# Altium schematic sheet IMX385_PINOUT.SchDoc
size C; SheetNumber: 2; SheetTotal: 3
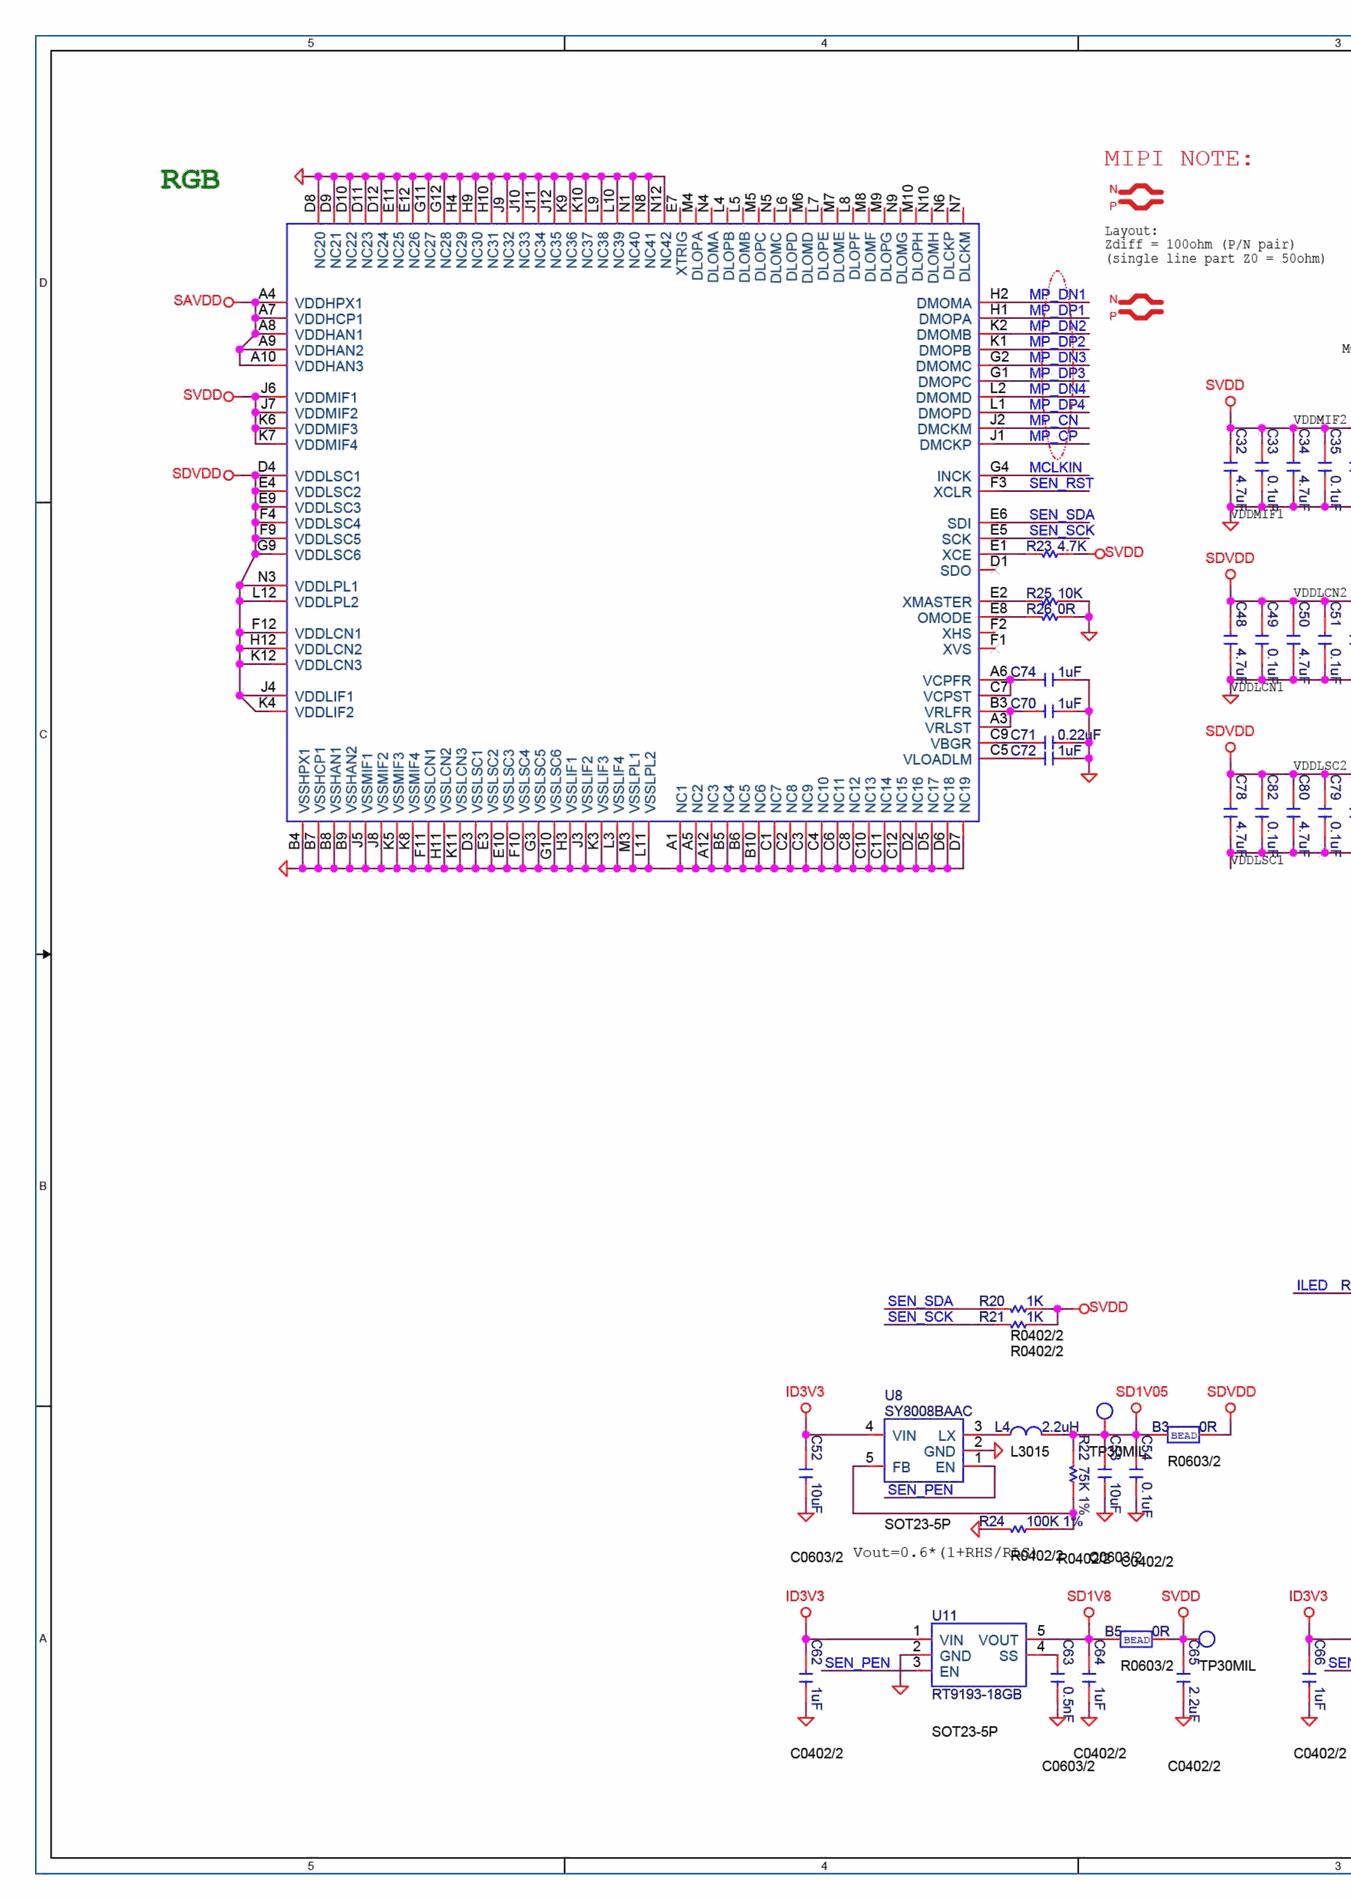
[diagram p0: IMX385_PINOUT.SchDoc, top left]
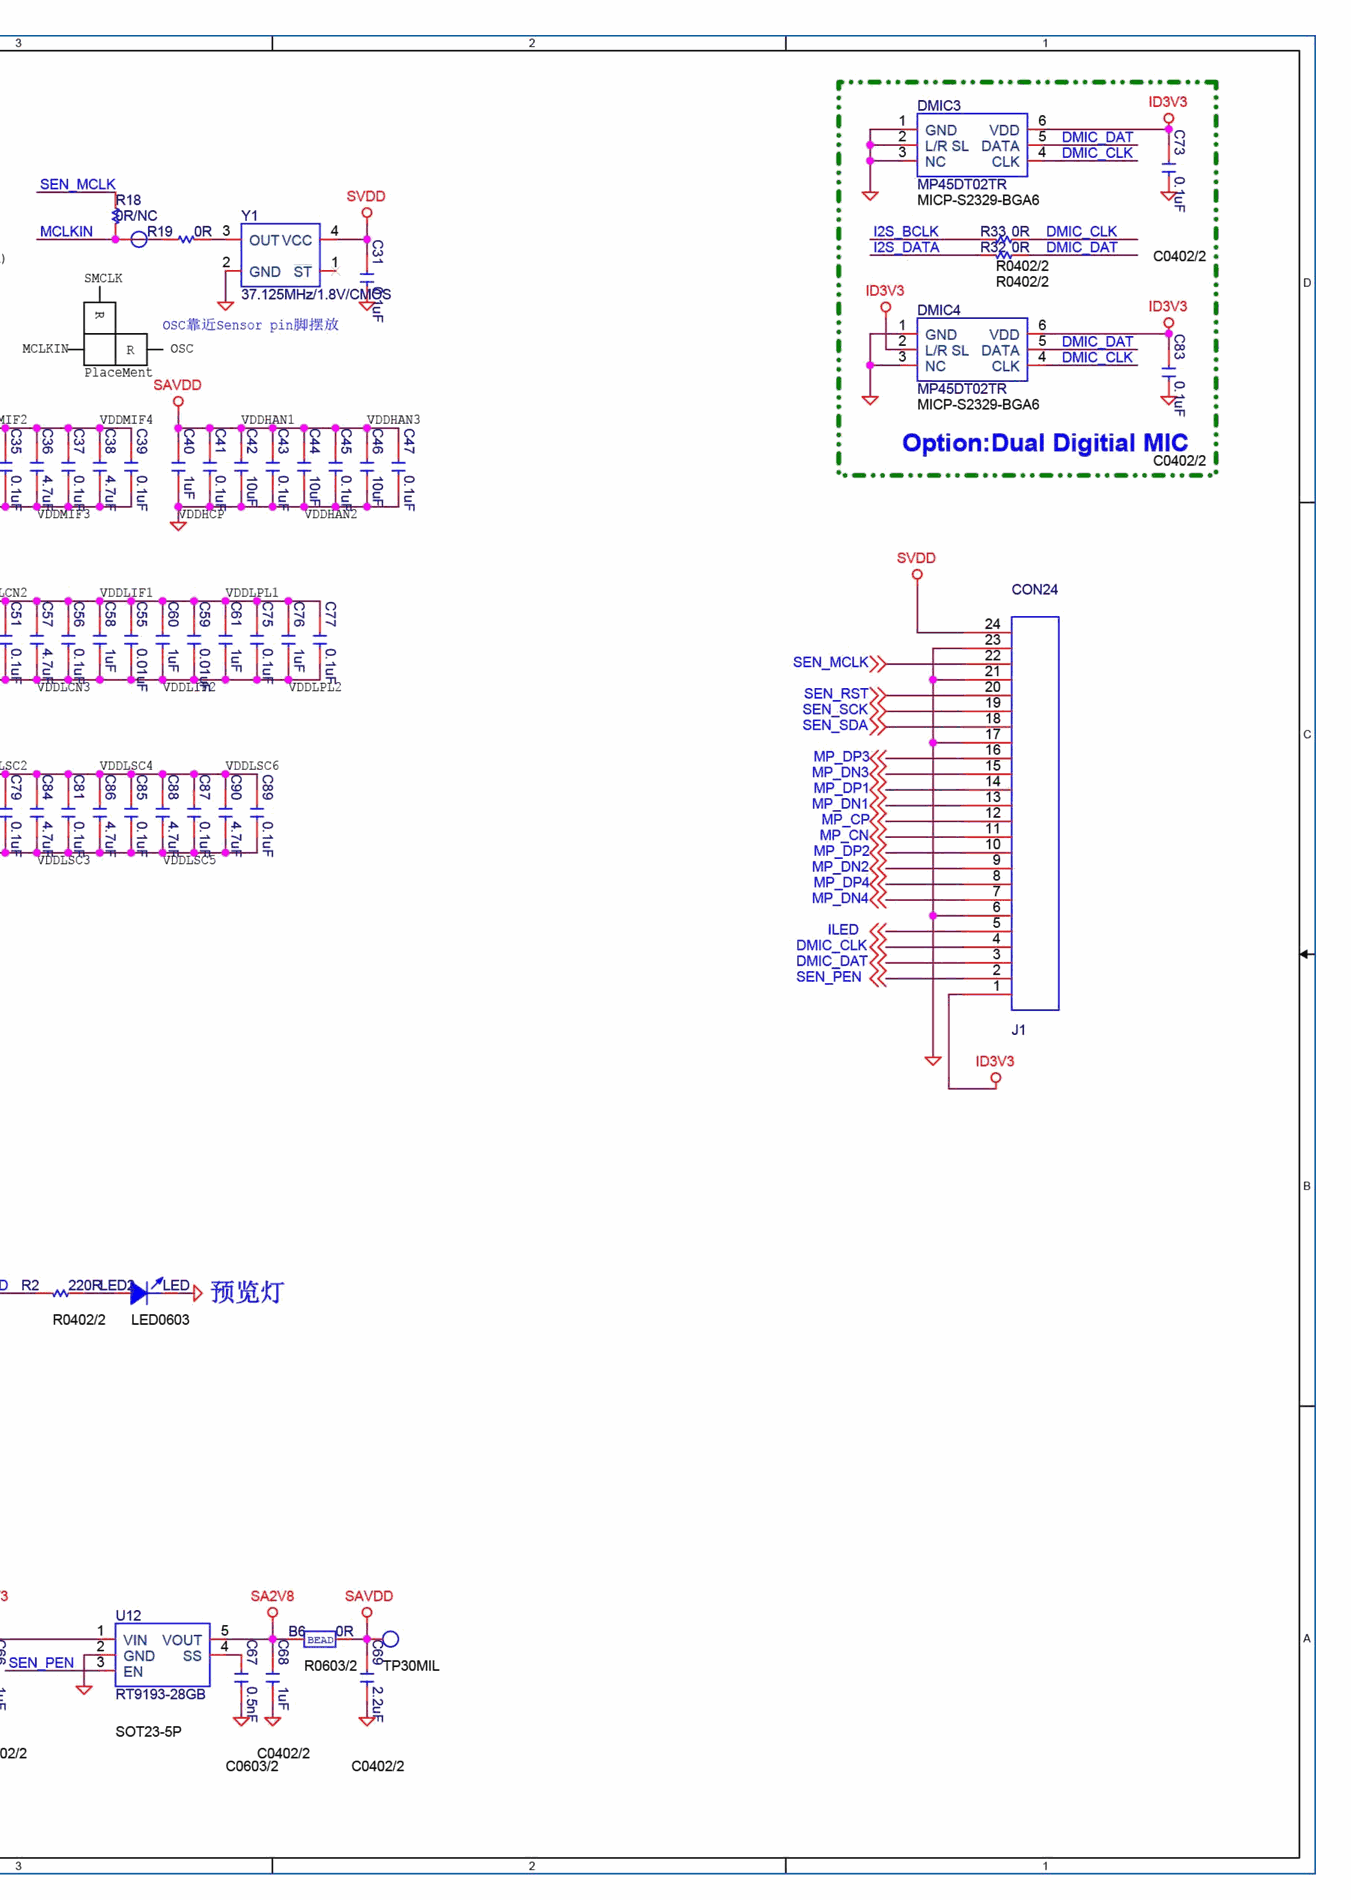
[diagram p1: IMX385_PINOUT.SchDoc, top right]
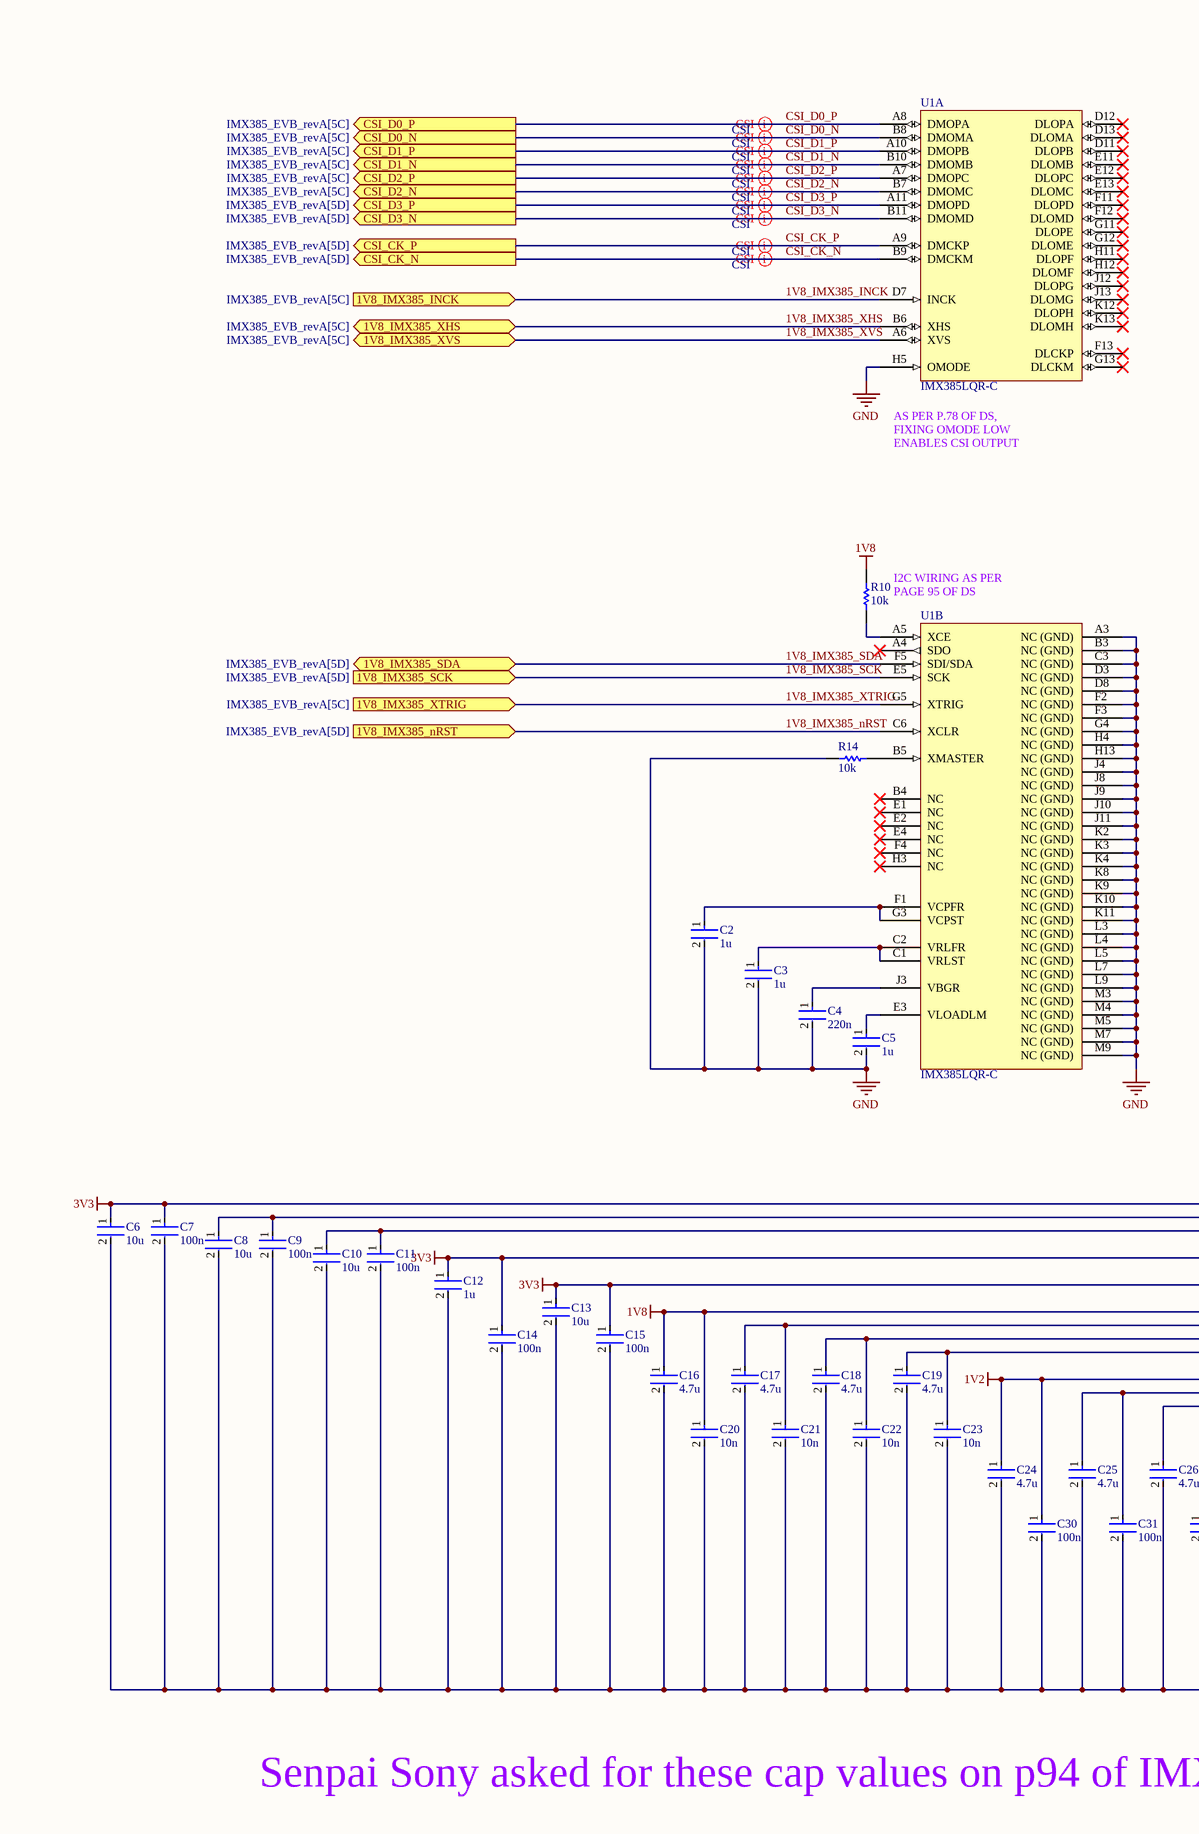
[diagram p2: IMX385_PINOUT.SchDoc, bottom left]
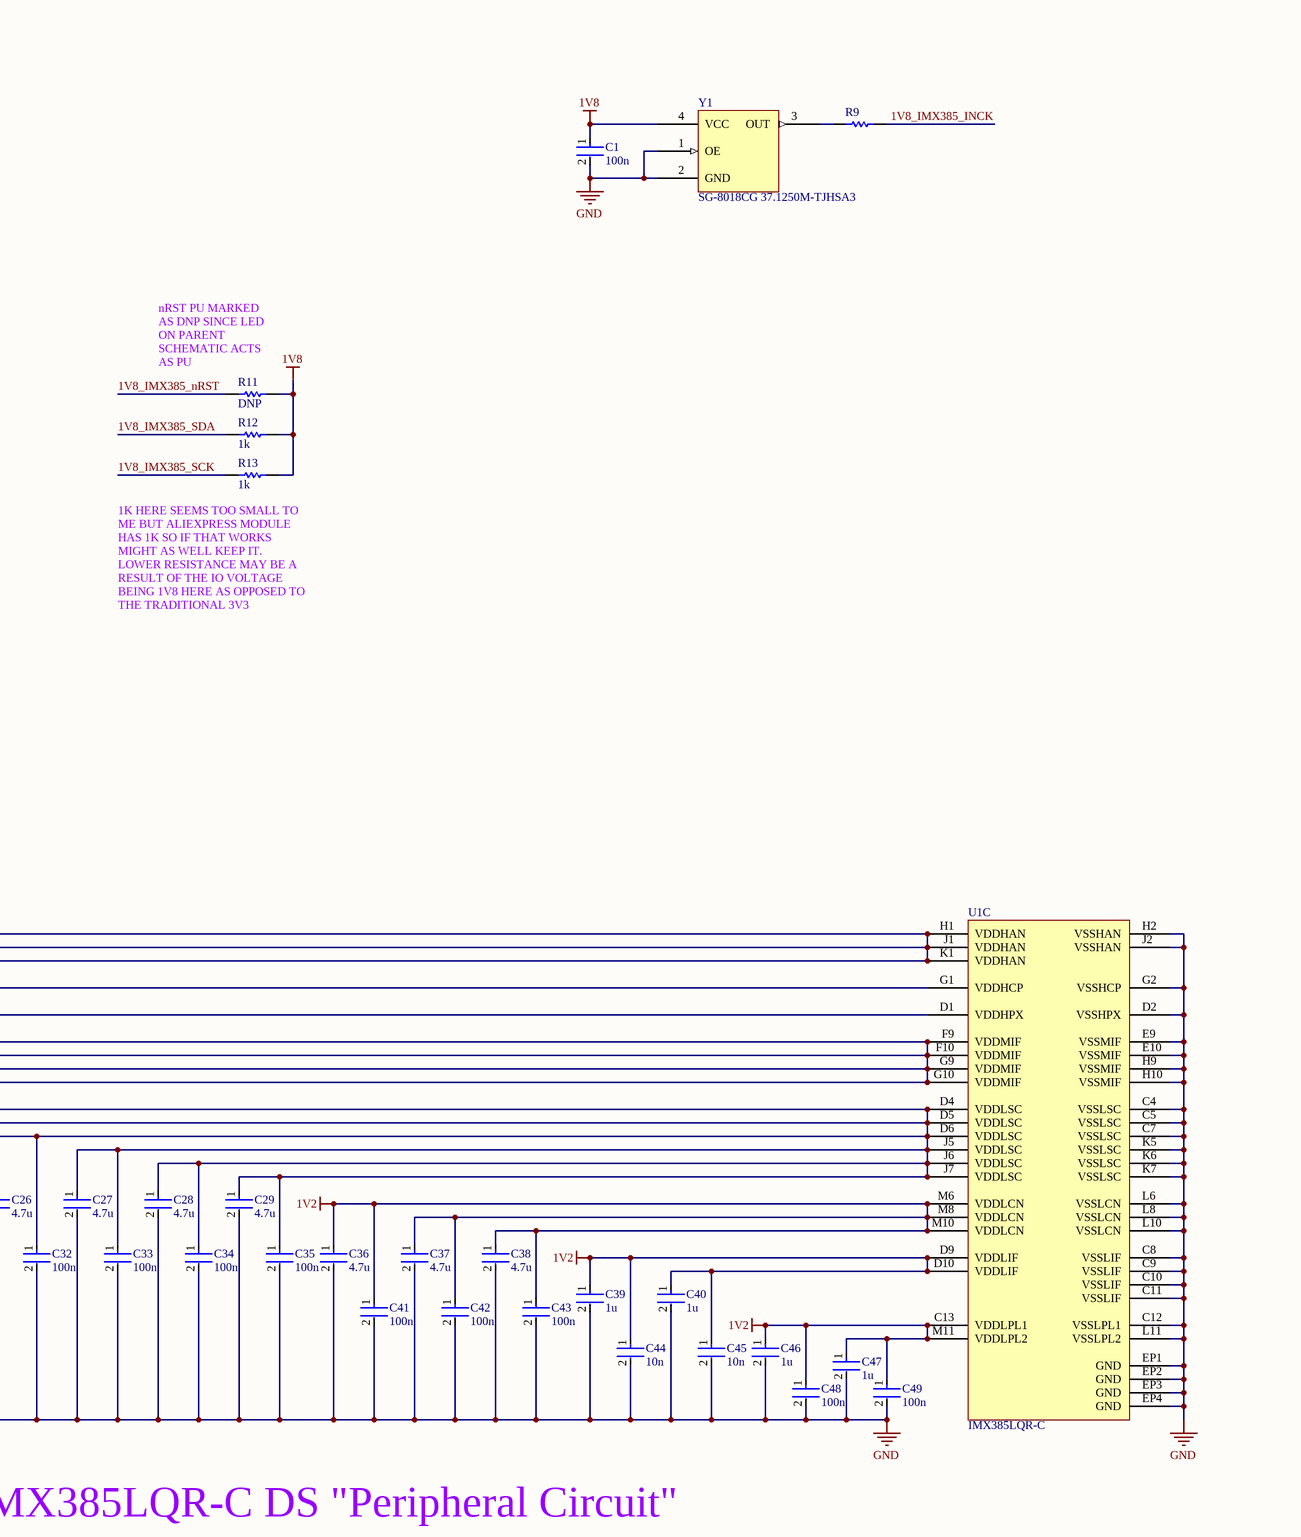
[diagram p3: IMX385_PINOUT.SchDoc, bottom right]

## Parts
C1  100n  [FP-0402-L_1_0_0_05-W_0_5-IPC_A]
C2  1u  [FP-0402-L_1_0_0_05-W_0_5-IPC_A]
C3  1u  [FP-0402-L_1_0_0_05-W_0_5-IPC_A]
C4  220n  [FP-0402-L_1_0_0_05-W_0_5-IPC_A]
C5  1u  [FP-0402-L_1_0_0_05-W_0_5-IPC_A]
C6  10u  [FP-0402-L_1_0_0_05-W_0_5-IPC_A]
C7  100n  [FP-0402-L_1_0_0_05-W_0_5-IPC_A]
C8  10u  [FP-0402-L_1_0_0_05-W_0_5-IPC_A]
C9  100n  [FP-0402-L_1_0_0_05-W_0_5-IPC_A]
C10  10u  [FP-0402-L_1_0_0_05-W_0_5-IPC_A]
C11  100n  [FP-0402-L_1_0_0_05-W_0_5-IPC_A]
C12  1u  [FP-0402-L_1_0_0_05-W_0_5-IPC_A]
C13  10u  [FP-0402-L_1_0_0_05-W_0_5-IPC_A]
C14  100n  [FP-0402-L_1_0_0_05-W_0_5-IPC_A]
C15  100n  [FP-0402-L_1_0_0_05-W_0_5-IPC_A]
C16  4.7u  [FP-0402-L_1_0_0_05-W_0_5-IPC_A]
C17  4.7u  [FP-0402-L_1_0_0_05-W_0_5-IPC_A]
C18  4.7u  [FP-0402-L_1_0_0_05-W_0_5-IPC_A]
C19  4.7u  [FP-0402-L_1_0_0_05-W_0_5-IPC_A]
C20  10n  [FP-0402-L_1_0_0_05-W_0_5-IPC_A]
C21  10n  [FP-0402-L_1_0_0_05-W_0_5-IPC_A]
C22  10n  [FP-0402-L_1_0_0_05-W_0_5-IPC_A]
C23  10n  [FP-0402-L_1_0_0_05-W_0_5-IPC_A]
C24  4.7u  [FP-0402-L_1_0_0_05-W_0_5-IPC_A]
C25  4.7u  [FP-0402-L_1_0_0_05-W_0_5-IPC_A]
C26  4.7u  [FP-0402-L_1_0_0_05-W_0_5-IPC_A]
C27  4.7u  [FP-0402-L_1_0_0_05-W_0_5-IPC_A]
C28  4.7u  [FP-0402-L_1_0_0_05-W_0_5-IPC_A]
C29  4.7u  [FP-0402-L_1_0_0_05-W_0_5-IPC_A]
C30  100n  [FP-0402-L_1_0_0_05-W_0_5-IPC_A]
C31  100n  [FP-0402-L_1_0_0_05-W_0_5-IPC_A]
C32  100n  [FP-0402-L_1_0_0_05-W_0_5-IPC_A]
C33  100n  [FP-0402-L_1_0_0_05-W_0_5-IPC_A]
C34  100n  [FP-0402-L_1_0_0_05-W_0_5-IPC_A]
C35  100n  [FP-0402-L_1_0_0_05-W_0_5-IPC_A]
C36  4.7u  [FP-0402-L_1_0_0_05-W_0_5-IPC_A]
C37  4.7u  [FP-0402-L_1_0_0_05-W_0_5-IPC_A]
C38  4.7u  [FP-0402-L_1_0_0_05-W_0_5-IPC_A]
C39  1u  [FP-0402-L_1_0_0_05-W_0_5-IPC_A]
C40  1u  [FP-0402-L_1_0_0_05-W_0_5-IPC_A]
C41  100n  [FP-0402-L_1_0_0_05-W_0_5-IPC_A]
C42  100n  [FP-0402-L_1_0_0_05-W_0_5-IPC_A]
C43  100n  [FP-0402-L_1_0_0_05-W_0_5-IPC_A]
C44  10n  [FP-0402-L_1_0_0_05-W_0_5-IPC_A]
C45  10n  [FP-0402-L_1_0_0_05-W_0_5-IPC_A]
C46  1u  [FP-0402-L_1_0_0_05-W_0_5-IPC_A]
C47  1u  [FP-0402-L_1_0_0_05-W_0_5-IPC_A]
C48  100n  [FP-0402-L_1_0_0_05-W_0_5-IPC_A]
C49  100n  [FP-0402-L_1_0_0_05-W_0_5-IPC_A]
R9  0402 JUMPER  [RESC1005X40X25ML05T05]  (value not drawn)
R10  10k  [R0603B]
R11  DNP  [R0603B]
R12  1k  [R0603B]
R13  1k  [R0603B]
R14  10k  [R0603B]
U1  IMX385LQR-C  [BGA128C100P13X12_1500X1250X225]  (parts A,B,C of 3)
Y1  SG-8018CG 37.1250M-TJHSA3  [SG-8018CG 37.1250M-TJHSA3-Footprint-1]

## Ports
1V8_IMX385_INCK (in, see IMX385_EVB_revA[5C]), 1V8_IMX385_nRST (in, see IMX385_EVB_revA[5D]), 1V8_IMX385_SCK (in, see IMX385_EVB_revA[5D]), 1V8_IMX385_SDA (bidir, see IMX385_EVB_revA[5D]), 1V8_IMX385_XHS (bidir, see IMX385_EVB_revA[5C]), 1V8_IMX385_XTRIG (in, see IMX385_EVB_revA[5C]), 1V8_IMX385_XVS (bidir, see IMX385_EVB_revA[5C]), CSI_CK_N (out, see IMX385_EVB_revA[5D]), CSI_CK_P (out, see IMX385_EVB_revA[5D]), CSI_D0_N (out, see IMX385_EVB_revA[5C]), CSI_D0_P (out, see IMX385_EVB_revA[5C]), CSI_D1_N (out, see IMX385_EVB_revA[5C]), CSI_D1_P (out, see IMX385_EVB_revA[5C]), CSI_D2_N (out, see IMX385_EVB_revA[5C]), CSI_D2_P (out, see IMX385_EVB_revA[5C]), CSI_D3_N (out, see IMX385_EVB_revA[5D]), CSI_D3_P (out, see IMX385_EVB_revA[5D])

## Nets
1V2: C24.1 C25.1 C26.1 C27.1 C28.1 C29.1 C30.1 C31.1 C32.1 C33.1 C34.1 C35.1 C36.1 C37.1 C38.1 C39.1 C40.1 C41.1 C42.1 C43.1 C44.1 C45.1 C46.1 C47.1 C48.1 C49.1 U1.C13(VDDLPL1) U1.D4(VDDLSC) U1.D5(VDDLSC) U1.D6(VDDLSC) U1.D9(VDDLIF) U1.D10(VDDLIF) U1.J5(VDDLSC) U1.J6(VDDLSC) U1.J7(VDDLSC) U1.M6(VDDLCN) U1.M8(VDDLCN) U1.M10(VDDLCN) U1.M11(VDDLPL2)
1V8: C1.1 C16.1 C17.1 C18.1 C19.1 C20.1 C21.1 C22.1 C23.1 R10.2 R11.1 R12.2 R13.2 U1.F9(VDDMIF) U1.F10(VDDMIF) U1.G9(VDDMIF) U1.G10(VDDMIF) Y1.4(VCC)
3V3: C6.1 C7.1 C8.1 C9.1 C10.1 C11.1 C12.1 C13.1 C14.1 C15.1 U1.D1(VDDHPX) U1.G1(VDDHCP) U1.H1(VDDHAN) U1.J1(VDDHAN) U1.K1(VDDHAN)
GND: C1.2 C2.2 C3.2 C4.2 C5.2 C6.2 C7.2 C8.2 C9.2 C10.2 C11.2 C12.2 C13.2 C14.2 C15.2 C16.2 C17.2 C18.2 C19.2 C20.2 C21.2 C22.2 C23.2 C24.2 C25.2 C26.2 C27.2 C28.2 C29.2 C30.2 C31.2 C32.2 C33.2 C34.2 C35.2 C36.2 C37.2 C38.2 C39.2 C40.2 C41.2 C42.2 C43.2 C44.2 C45.2 C46.2 C47.2 C48.2 C49.2 R14.2 U1.A3(NC_(GND)) U1.B3(NC_(GND)) U1.C3(NC_(GND)) U1.C4(VSSLSC) U1.C5(VSSLSC) U1.C7(VSSLSC) U1.C8(VSSLIF) U1.C9(VSSLIF) U1.C10(VSSLIF) U1.C11(VSSLIF) U1.C12(VSSLPL1) U1.D2(VSSHPX) U1.D3(NC_(GND)) U1.D8(NC_(GND)) U1.E9(VSSMIF) U1.E10(VSSMIF) U1.EP1(GND) U1.EP2(GND) U1.EP3(GND) U1.EP4(GND) U1.F2(NC_(GND)) U1.F3(NC_(GND)) U1.G2(VSSHCP) U1.G4(NC_(GND)) U1.H2(VSSHAN) U1.H4(NC_(GND)) U1.H5(OMODE) U1.H9(VSSMIF) U1.H10(VSSMIF) U1.H13(NC_(GND)) U1.J2(VSSHAN) U1.J4(NC_(GND)) U1.J8(NC_(GND)) U1.J9(NC_(GND)) U1.J10(NC_(GND)) U1.J11(NC_(GND)) U1.K2(NC_(GND)) U1.K3(NC_(GND)) U1.K4(NC_(GND)) U1.K5(VSSLSC) U1.K6(VSSLSC) U1.K7(VSSLSC) U1.K8(NC_(GND)) U1.K9(NC_(GND)) U1.K10(NC_(GND)) U1.K11(NC_(GND)) U1.L3(NC_(GND)) U1.L4(NC_(GND)) U1.L5(NC_(GND)) U1.L6(VSSLCN) U1.L7(NC_(GND)) U1.L8(VSSLCN) U1.L9(NC_(GND)) U1.L10(VSSLCN) U1.L11(VSSLPL2) U1.M3(NC_(GND)) U1.M4(NC_(GND)) U1.M5(NC_(GND)) U1.M7(NC_(GND)) U1.M9(NC_(GND)) Y1.1(OE) Y1.2(GND)
1V8_IMX385_INCK: R9.2 U1.D7(INCK) ; port 1V8_IMX385_INCK
1V8_IMX385_nRST: R11.2 U1.C6(XCLR) ; port 1V8_IMX385_nRST
1V8_IMX385_SCK: R13.1 U1.E5(SCK) ; port 1V8_IMX385_SCK
1V8_IMX385_SDA: R12.1 U1.F5(SDI/SDA) ; port 1V8_IMX385_SDA
1V8_IMX385_XHS: U1.B6(XHS) ; port 1V8_IMX385_XHS
1V8_IMX385_XTRIG: U1.G5(XTRIG) ; port 1V8_IMX385_XTRIG
1V8_IMX385_XVS: U1.A6(XVS) ; port 1V8_IMX385_XVS
CSI_CK_N: U1.B9(DMCKM) ; port CSI_CK_N
CSI_CK_P: U1.A9(DMCKP) ; port CSI_CK_P
CSI_D0_N: U1.B8(DMOMA) ; port CSI_D0_N
CSI_D0_P: U1.A8(DMOPA) ; port CSI_D0_P
CSI_D1_N: U1.B10(DMOMB) ; port CSI_D1_N
CSI_D1_P: U1.A10(DMOPB) ; port CSI_D1_P
CSI_D2_N: U1.B7(DMOMC) ; port CSI_D2_N
CSI_D2_P: U1.A7(DMOPC) ; port CSI_D2_P
CSI_D3_N: U1.B11(DMOMD) ; port CSI_D3_N
CSI_D3_P: U1.A11(DMOPD) ; port CSI_D3_P
NetC2_1: C2.1 U1.F1(VCPFR) U1.G3(VCPST)
NetC3_1: C3.1 U1.C1(VRLST) U1.C2(VRLFR)
NetC4_1: C4.1 U1.J3(VBGR)
NetC5_1: C5.1 U1.E3(VLOADLM)
NetR9_1: R9.1 Y1.3(OUT)
NetR10_1: R10.1 U1.A5(XCE)
NetR14_1: R14.1 U1.B5(XMASTER)

Not connected (* = marked no-connect by the designer): U1 A4(SDO)* B4(NC)* D11(DLOPB)* D12(DLOPA)* D13(DLOMA)* E1(NC)* E2(NC)* E4(NC)* E11(DLOMB)* E12(DLOPC)* E13(DLOMC)* F4(NC)* F11(DLOPD)* F12(DLOMD)* F13(DLCKP)* G11(DLOPE)* G12(DLOME)* G13(DLCKM)* H3(NC)* H11(DLOPF)* H12(DLOMF)* J12(DLOPG)* J13(DLOMG)* K12(DLOPH)* K13(DLOMH)*

## Layout directives
differential pair; differential pair class CSI: CSI_CK_N, CSI_CK_P, CSI_D0_N, CSI_D0_P, CSI_D1_N, CSI_D1_P, CSI_D2_N, CSI_D2_P, CSI_D3_N, CSI_D3_P

## Notes on the sheet
- (near U1) AS PER P.78 OF DS, FIXING OMODE LOW ENABLES CSI OUTPUT
- I2C WIRING AS PER PAGE 95 OF DS
- (near R11) nRST PU MARKED AS DNP SINCE LED ON PARENT SCHEMATIC ACTS AS PU
- (near R13) 1K HERE SEEMS TOO SMALL TO ME BUT ALIEXPRESS MODULE HAS 1K SO IF THAT WORKS MIGHT AS WELL KEEP IT. LOWER RESISTANCE MAY BE A RESULT OF THE IO VOLTAGE BEING 1V8 HERE AS OPPOSED TO THE TRADITIONAL 3V3
- Senpai Sony asked for these cap values on p94 of IMX385LQR-C DS "Peripheral Circuit"

## Library data of the parts
C1-C49 = CMP-001-00058-1: LARGE PADS, 0402 CAP, CHANGE COMMENT TO MATCH REAL P/N; Capacitor Type: Ceramic; Min Operating Temperature: -55°C; Mounting Technology: Surface Mount; Pins: 2; Case/Package: 0402; RoHS Compliant: Yes; Max Operating Temperature: 85°C
R9 = CMP-009-00118-2: READ THE NAME; Pins: 2; Component Type: Standard; Design Item ID: CMP-009-00206-2; Source: 0402jump.SchLib
R10 R12-R14 = CMP-009-00002-14: Resistor
  R10 R14: Value: 10k
  R12 R13: Value: 1k
R11 = CMP-009-00002-14: Resistor; Value: 10k
U1 = CMP-010-00040-3: Sony Starvis 2.13MP MIPI 1/2" Image Sensor
Y1 = CMP-003-00017-1: SG-8018CG 37.1250M-TJHSA3: Mhz Osc 1.8V~3.3V +/-50PPM -40~105C St 250TR; Load Capacitance: 15pF; Frequency: 37.125MHz; Mounting Technology: Surface Mount; Min Operating Temperature: -40°C; Max Operating Temperature: 105°C